# EAGLE board LTC6811_slave_24s_rev0 (EAGLE 9.3.1)
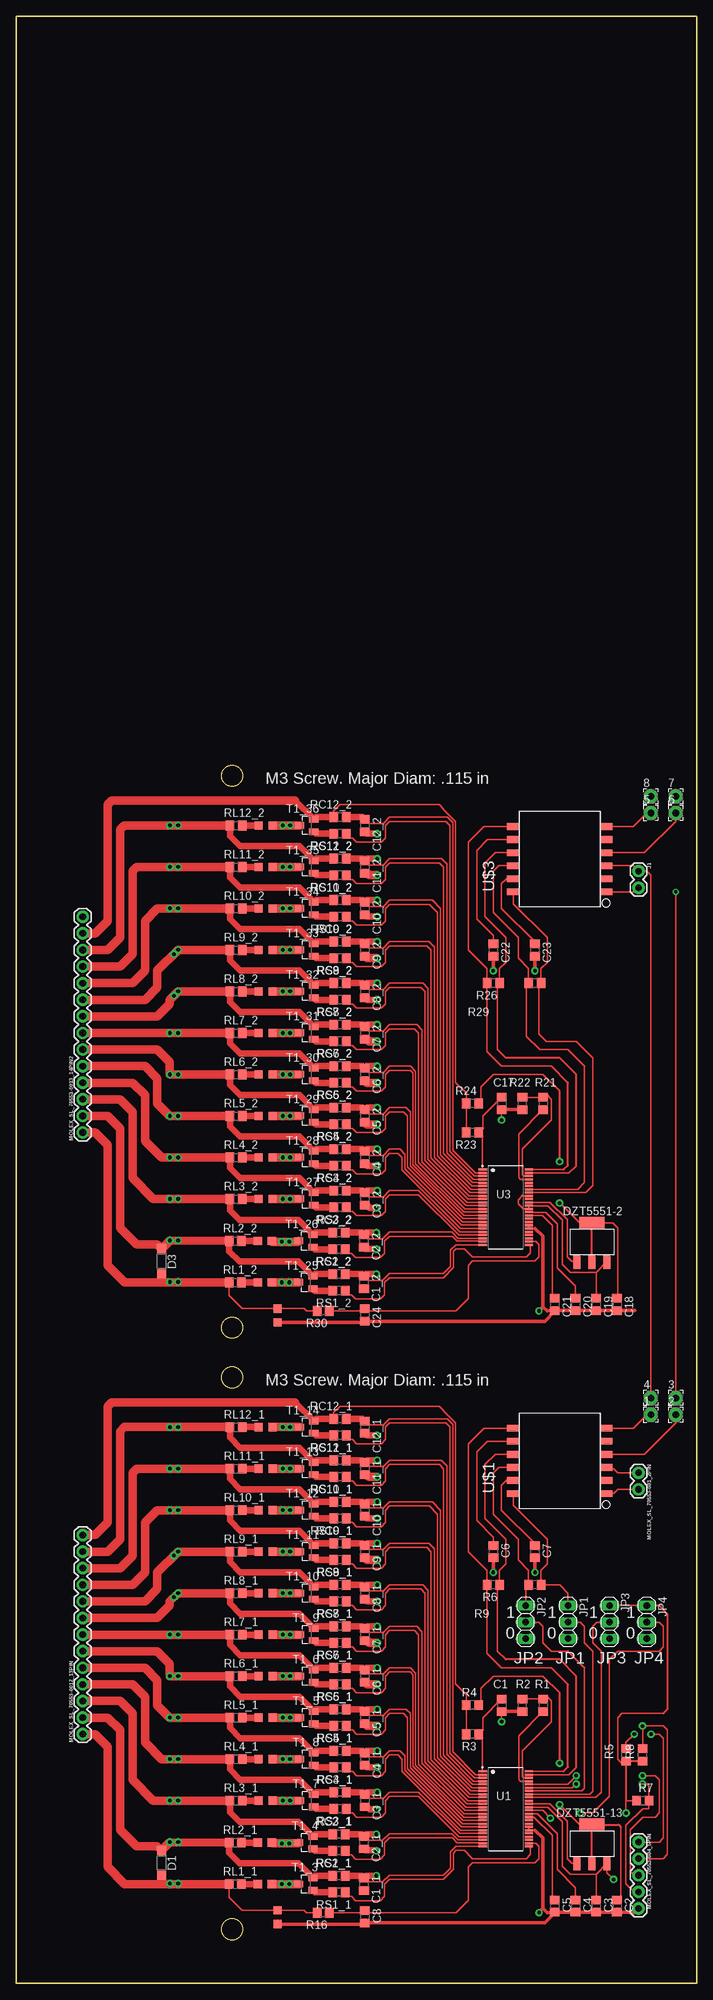
[diagram p2: board, top side]
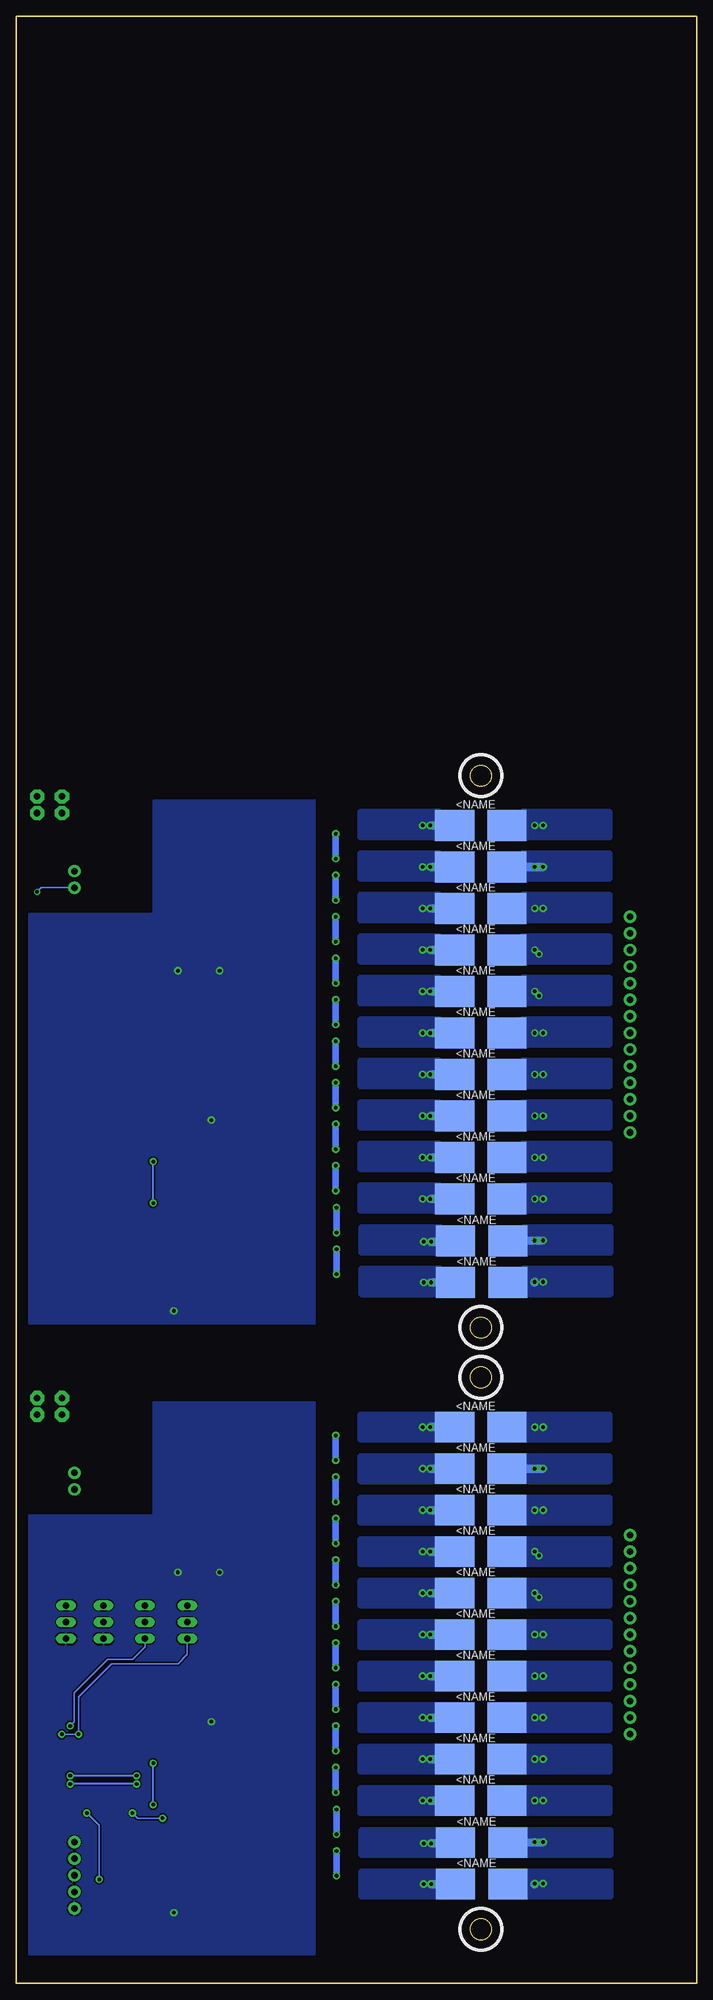
[diagram p3: board, bottom side, seen from below]

Size 104.14 x 300.99 mm. Coordinates in mm from the lower left corner, seen from the top.
Outline: 0,0 104.14,0 104.14,300.99 0,300.99 0,0
Outline: circle at 33.02,92.71 radius 1.59
Outline: circle at 33.02,8.26 radius 1.59
Outline: circle at 33.02,184.78 radius 1.59
Outline: circle at 33.02,100.33 radius 1.59
Copper layers (1*16): Top 0.035mm / dielectric 1.5mm / Bottom 0.035mm
Design rules "default *": minimum track width 6mil, minimum drill 0.53mm, track to track 8mil, track to pad 6mil, pad to pad 6mil, via to via 6mil, smd to smd 6mil, copper to edge 40mil, drill to drill 6mil, minimum pad ring 10mil, minimum via ring 8mil, stop-mask expansion 4mil, vias tented up to drill 0mil, thermal gap 10mil

## Footprints (pad centres in the part's own frame; a part is rotated, then mirrored left to right if it is on the bottom)
2,15/1,0 = drill 1.016 pad 2.159 octagon: 1 0,0
C0805 = smd 1.3 x 1.5: 1 -0.95,0; 2 0.95,0
SOD123 = smd 1.4 x 1.4: A 1.9,0; C -1.9,0
SOT223-4 = smd 1.067 x 2.184: B -2.3,-3; C@2 0,-3; E 2.3,-3 | smd 3.81 x 1.93: C 0,2.9
1X02 = drill 1.016 pad 1.88: 1 0,0; 2 2.54,0
1X03 = drill 1.016 long: 1 -2.54,0; 2 0,0; 3 2.54,0
0805_COMPONENT = smd 1.27 x 1.27: 1 -1,0; 2 1.127,0
1X05 = drill 1.016 pad 1.88: 1 0,0; 2 2.54,0; 3 5.08,0; 4 7.62,0; 5 10.16,0
1X13 = drill 1.016 pad 1.88: 1 0,0; 2 2.54,0; 3 5.08,0; 4 7.62,0; 5 10.16,0; 6 12.7,0; 7 15.24,0; 8 17.78,0; 9 20.32,0; 10 22.86,0; 11 25.4,0; 12 27.94,0; 13 30.48,0
1X14 = drill 1.016 pad 1.88: 1 0,0; 2 2.54,0; 3 5.08,0; 4 7.62,0; 5 10.16,0; 6 12.7,0; 7 15.24,0; 8 17.78,0; 9 20.32,0; 10 22.86,0; 11 25.4,0; 12 27.94,0; 13 30.48,0; 14 33.02,0
R0805 = smd 1.3 x 1.5: 1 -0.95,0; 2 0.95,0
2817_COMPONENT = smd 6 x 4.7: 1 -4,0; 2 4,0
SOT23 = smd 1 x 1.4: C 0.95,-1.1; E 0,1.1; G -0.95,-1.1
LTC6811-1 = smd 1.44 x 0.34: 1 -3.54,5.75; 2 -3.54,5.25; 3 -3.54,4.75; 4 -3.54,4.25; 5 -3.54,3.75; 6 -3.54,3.25; 7 -3.54,2.75; 8 -3.54,2.25; 9 -3.54,1.75; 10 -3.54,1.25; 11 -3.54,0.75; 12 -3.54,0.25; 13 -3.54,-0.25; 14 -3.54,-0.75; 15 -3.54,-1.25; 16 -3.54,-1.75; 17 -3.54,-2.25; 18 -3.54,-2.75; 19 -3.54,-3.25; 20 -3.54,-3.75; 21 -3.54,-4.25; 22 -3.54,-4.75; 23 -3.54,-5.25; 24 -3.54,-5.75; 25 3.54,-5.75; 26 3.54,-5.25; 27 3.54,-4.75; 28 3.54,-4.25; 29 3.54,-3.75; 30 3.54,-3.25; 31 3.54,-2.75; 32 3.54,-2.25; 33 3.54,-1.75; 34 3.54,-1.25; 35 3.54,-0.75; 36 3.54,-0.25; 37 3.54,0.25; 38 3.54,0.75; 39 3.54,1.25; 40 3.54,1.75; 41 3.54,2.25; 42 3.54,2.75; 43 3.54,3.25; 44 3.54,3.75; 45 3.54,4.25; 46 3.54,4.75; 47 3.54,5.25; 48 3.54,5.75
HM2112ZNL_12SMT = smd 1.02 x 1.89: 1 0,-7.145; 2 2,-7.145; 3 4,-7.145; 4 6,-7.145; 5 8,-7.145; 6 10,-7.145; 7 10,7.145; 8 8,7.145; 9 6,7.145; 10 4,7.145; 11 2,7.145; 12 0,7.145

## Placement (x,y rotation side)
1  [2,15/1,0]  97.16,87 0 top
2  [2,15/1,0]  100.97,87 0 top
3  [2,15/1,0]  100.97,89.53 0 top
4  [2,15/1,0]  97.16,89.53 0 top
5  [2,15/1,0]  97.16,179.07 0 top
6  [2,15/1,0]  100.97,179.07 0 top
7  [2,15/1,0]  100.97,181.61 0 top
8  [2,15/1,0]  97.16,181.61 0 top
C1  100.0nF  [C0805]  74.3,42.55 270 top
C1_1  10nF  [C0805]  53.21,15.16 270 top
C1_2  10nF  [C0805]  53.21,107.24 270 top
C2  100nF  [C0805]  91.95,11.81 270 top
C2_1  10nF  [C0805]  53.21,21.51 270 top
C2_2  10nF  [C0805]  53.21,113.59 270 top
C3  1uF  [C0805]  88.77,11.81 270 top
C3_1  10nF  [C0805]  53.34,27.94 270 top
C3_2  10nF  [C0805]  53.34,120.02 270 top
C4  1uF  [C0805]  85.6,11.81 270 top
C4_1  10nF  [C0805]  53.34,34.29 270 top
C4_2  10nF  [C0805]  53.34,126.36 270 top
C5  1uF  [C0805]  82.42,11.81 270 top
C5_1  10nF  [C0805]  53.34,40.64 270 top
C5_2  10nF  [C0805]  53.34,132.71 270 top
C6  10nF  [C0805]  73.03,66.04 270 top
C6_1  10nF  [C0805]  53.34,46.99 270 top
C6_2  10nF  [C0805]  53.34,139.06 270 top
C7  10nF  [C0805]  79.38,66.04 270 top
C7_1  10nF  [C0805]  53.34,53.34 270 top
C7_2  10nF  [C0805]  53.34,145.41 270 top
C8  10nF  [C0805]  53.34,10.16 270 top
C8_1  10nF  [C0805]  53.34,59.69 270 top
C8_2  10nF  [C0805]  53.34,151.76 270 top
C9_1  10nF  [C0805]  53.34,66.04 270 top
C9_2  10nF  [C0805]  53.34,158.11 270 top
C10_1  10nF  [C0805]  53.34,72.39 270 top
C10_2  10nF  [C0805]  53.34,164.46 270 top
C11_1  10nF  [C0805]  53.34,78.74 270 top
C11_2  10nF  [C0805]  53.34,170.81 270 top
C12_1  10nF  [C0805]  53.34,85.09 270 top
C12_2  10nF  [C0805]  53.34,177.16 270 top
C17  100.0nF  [C0805]  74.3,134.62 270 top
C18  100nF  [C0805]  91.95,103.89 270 top
C19  1uF  [C0805]  88.77,103.89 270 top
C20  1uF  [C0805]  85.6,103.89 270 top
C21  1uF  [C0805]  82.42,103.89 270 top
C22  10nF  [C0805]  73.03,158.11 270 top
C23  10nF  [C0805]  79.38,158.11 270 top
C24  10nF  [C0805]  53.34,102.23 270 top
D1  BAT46W-7-F  [SOD123]  22.23,18.41 270 top
D3  BAT46W-7-F  [SOD123]  22.23,110.49 270 top
DZT5551-2  DZT5551-13  [SOT223-4]  88.14,113.41 0 top
DZT5551-13  DZT5551-13  [SOT223-4]  88.14,21.34 0 top
J1  [1X02]  95.25,170.18 270 top
JP1  [1X03]  84.45,55.25 270 top
JP2  [1X03]  77.98,55.25 270 top
JP3  [1X03]  90.81,55.25 270 top
JP4  [1X03]  96.52,55.25 270 top
L1  600 OHMS  [0805_COMPONENT]  40,10.16 270 top
L2  600 OHMS  [0805_COMPONENT]  40,102.23 270 top
LED1_3  LED_0805  [0805_COMPONENT]  37.97,15.16 0 top
LED1_4  LED_0805  [0805_COMPONENT]  37.97,21.51 0 top
LED1_5  LED_0805  [0805_COMPONENT]  38.1,40.64 0 top
LED1_6  LED_0805  [0805_COMPONENT]  38.1,46.99 0 top
LED1_7  LED_0805  [0805_COMPONENT]  38.1,27.94 0 top
LED1_8  LED_0805  [0805_COMPONENT]  38.1,34.29 0 top
LED1_9  LED_0805  [0805_COMPONENT]  38.1,53.34 0 top
LED1_10  LED_0805  [0805_COMPONENT]  38.1,59.69 0 top
LED1_11  LED_0805  [0805_COMPONENT]  38.1,66.04 0 top
LED1_12  LED_0805  [0805_COMPONENT]  38.1,72.39 0 top
LED1_13  LED_0805  [0805_COMPONENT]  38.1,78.74 0 top
LED1_14  LED_0805  [0805_COMPONENT]  38.1,85.09 0 top
LED1_25  LED_0805  [0805_COMPONENT]  37.97,107.24 0 top
LED1_26  LED_0805  [0805_COMPONENT]  37.97,113.59 0 top
LED1_27  LED_0805  [0805_COMPONENT]  38.1,120.02 0 top
LED1_28  LED_0805  [0805_COMPONENT]  38.1,126.36 0 top
LED1_29  LED_0805  [0805_COMPONENT]  38.1,132.71 0 top
LED1_30  LED_0805  [0805_COMPONENT]  38.1,139.06 0 top
LED1_31  LED_0805  [0805_COMPONENT]  38.1,145.41 0 top
LED1_32  LED_0805  [0805_COMPONENT]  38.1,151.76 0 top
LED1_33  LED_0805  [0805_COMPONENT]  38.1,158.11 0 top
LED1_34  LED_0805  [0805_COMPONENT]  38.1,164.46 0 top
LED1_35  LED_0805  [0805_COMPONENT]  38.1,170.81 0 top
LED1_36  LED_0805  [0805_COMPONENT]  38.1,177.16 0 top
MOLEX_SL_70553-001_2PIN  [1X02]  95.25,78.11 270 top
MOLEX_SL_70553-004_5PIN  [1X05]  95.25,21.59 270 top
MOLEX_SL_70553-0012_13PIN  [1X13]  10.16,38.1 90 top
MOLEX_SL_70553-0013_14PIN2  [1X14]  10.16,130.17 90 top
R1  1k  [R0805]  80.64,42.55 270 top
R2  1k  [R0805]  77.47,42.55 90 top
R3  100.0  [R0805]  69.85,38.1 180 top
R4  100.0  [R0805]  69.85,42.55 180 top
R5  1M  [R0805]  93.34,34.93 90 top
R6  100  [R0805]  73.03,60.96 180 top
R7  1M  [R0805]  95.89,27.94 0 top
R8  1M  [R0805]  95.89,34.93 90 top
R9  100  [R0805]  79.38,60.96 180 top
R16  100.0  [R0805]  46.99,10.79 180 top
R21  1k  [R0805]  80.64,134.62 270 top
R22  1k  [R0805]  77.47,134.62 90 top
R23  100.0  [R0805]  69.85,130.17 180 top
R24  100.0  [R0805]  69.85,134.62 180 top
R26  100  [R0805]  73.03,153.03 180 top
R29  100  [R0805]  79.38,153.03 180 top
R30  100.0  [R0805]  46.99,102.87 180 top
RB1_1  27  [2817_COMPONENT]  32.89,15.16 0 bottom
RB1_2  27  [2817_COMPONENT]  32.89,107.24 0 bottom
RB2_1  27  [2817_COMPONENT]  32.89,21.51 0 bottom
RB2_2  27  [2817_COMPONENT]  32.89,113.59 0 bottom
RB3_1  27  [2817_COMPONENT]  33.02,27.94 0 bottom
RB3_2  27  [2817_COMPONENT]  33.02,120.02 0 bottom
RB4_1  27  [2817_COMPONENT]  33.02,34.29 0 bottom
RB4_2  27  [2817_COMPONENT]  33.02,126.36 0 bottom
RB5_1  27  [2817_COMPONENT]  33.02,40.64 0 bottom
RB5_2  27  [2817_COMPONENT]  33.02,132.71 0 bottom
RB6_1  27  [2817_COMPONENT]  33.02,46.99 0 bottom
RB6_2  27  [2817_COMPONENT]  33.02,139.06 0 bottom
RB7_1  27  [2817_COMPONENT]  33.02,53.34 0 bottom
RB7_2  27  [2817_COMPONENT]  33.02,145.41 0 bottom
RB8_1  27  [2817_COMPONENT]  33.02,59.69 0 bottom
RB8_2  27  [2817_COMPONENT]  33.02,151.76 0 bottom
RB9_1  27  [2817_COMPONENT]  33.02,66.04 0 bottom
RB9_2  27  [2817_COMPONENT]  33.02,158.11 0 bottom
RB10_1  27  [2817_COMPONENT]  33.02,72.39 0 bottom
RB10_2  27  [2817_COMPONENT]  33.02,164.46 0 bottom
RB11_1  27  [2817_COMPONENT]  33.02,78.74 0 bottom
RB11_2  27  [2817_COMPONENT]  33.02,170.81 0 bottom
RB12_1  27  [2817_COMPONENT]  33.02,85.09 0 bottom
RB12_2  27  [2817_COMPONENT]  33.02,177.16 0 bottom
RC1_1  100.0  [R0805]  49.4,16.43 180 top
RC1_2  100.0  [R0805]  49.4,108.51 180 top
RC2_1  100.0  [R0805]  49.4,22.78 180 top
RC2_2  100.0  [R0805]  49.4,114.86 180 top
RC3_1  100.0  [R0805]  49.53,29.21 180 top
RC3_2  100.0  [R0805]  49.53,121.28 180 top
RC4_1  100.0  [R0805]  49.53,35.56 180 top
RC4_2  100.0  [R0805]  49.53,127.64 180 top
RC5_1  100.0  [R0805]  49.53,41.91 180 top
RC5_2  100.0  [R0805]  49.53,133.98 180 top
RC6_1  100.0  [R0805]  49.53,48.26 180 top
RC6_2  100.0  [R0805]  49.53,140.33 180 top
RC7_1  100.0  [R0805]  49.53,54.61 180 top
RC7_2  100.0  [R0805]  49.53,146.68 180 top
RC8_1  100.0  [R0805]  49.53,60.96 180 top
RC8_2  100.0  [R0805]  49.53,153.03 180 top
RC9_1  100.0  [R0805]  49.53,67.31 180 top
RC9_2  100.0  [R0805]  49.53,159.38 180 top
RC10_1  100.0  [R0805]  49.53,73.66 180 top
RC10_2  100.0  [R0805]  49.53,165.73 180 top
RC11_1  100.0  [R0805]  49.53,80.01 180 top
RC11_2  100.0  [R0805]  49.53,172.08 180 top
RC12_1  100.0  [R0805]  49.53,86.36 180 top
RC12_2  100.0  [R0805]  49.53,178.43 180 top
RL1_1  140  [R0805]  33.53,15.16 0 top
RL1_2  140  [R0805]  33.53,107.24 0 top
RL2_1  140  [R0805]  33.53,21.51 0 top
RL2_2  140  [R0805]  33.53,113.59 0 top
RL3_1  140  [R0805]  33.66,27.94 0 top
RL3_2  140  [R0805]  33.66,120.02 0 top
RL4_1  140  [R0805]  33.66,34.29 0 top
RL4_2  140  [R0805]  33.66,126.36 0 top
RL5_1  140  [R0805]  33.66,40.64 0 top
RL5_2  140  [R0805]  33.66,132.71 0 top
RL6_1  140  [R0805]  33.66,46.99 0 top
RL6_2  140  [R0805]  33.66,139.06 0 top
RL7_1  140  [R0805]  33.66,53.34 0 top
RL7_2  140  [R0805]  33.66,145.41 0 top
RL8_1  140  [R0805]  33.66,59.69 0 top
RL8_2  140  [R0805]  33.66,151.76 0 top
RL9_1  140  [R0805]  33.66,66.04 0 top
RL9_2  140  [R0805]  33.66,158.11 0 top
RL10_1  140  [R0805]  33.66,72.39 0 top
RL10_2  140  [R0805]  33.66,164.46 0 top
RL11_1  140  [R0805]  33.66,78.74 0 top
RL11_2  140  [R0805]  33.66,170.81 0 top
RL12_1  140  [R0805]  33.66,85.09 0 top
RL12_2  140  [R0805]  33.66,177.16 0 top
RS1_1  3.3k  [R0805]  49.4,13.89 180 top
RS1_2  3.3k  [R0805]  49.4,105.97 180 top
RS2_1  3.3k  [R0805]  49.4,20.24 180 top
RS2_2  3.3k  [R0805]  49.4,112.32 180 top
RS3_1  3.3k  [R0805]  49.53,26.67 180 top
RS3_2  3.3k  [R0805]  49.53,118.75 180 top
RS4_1  3.3k  [R0805]  49.53,33.02 180 top
RS4_2  3.3k  [R0805]  49.53,125.1 180 top
RS5_1  3.3k  [R0805]  49.53,39.37 180 top
RS5_2  3.3k  [R0805]  49.53,131.44 180 top
RS6_1  3.3k  [R0805]  49.53,45.72 180 top
RS6_2  3.3k  [R0805]  49.53,137.79 180 top
RS7_1  3.3k  [R0805]  49.53,52.07 180 top
RS7_2  3.3k  [R0805]  49.53,144.14 180 top
RS8_1  3.3k  [R0805]  49.53,58.42 180 top
RS8_2  3.3k  [R0805]  49.53,150.49 180 top
RS9_1  3.3k  [R0805]  49.53,64.77 180 top
RS9_2  3.3k  [R0805]  49.53,156.84 180 top
RS10_1  3.3k  [R0805]  49.53,71.12 180 top
RS10_2  3.3k  [R0805]  49.53,163.19 180 top
RS11_1  3.3k  [R0805]  49.53,77.47 180 top
RS11_2  3.3k  [R0805]  49.53,169.54 180 top
RS12_1  3.3k  [R0805]  49.53,83.82 180 top
RS12_2  3.3k  [R0805]  49.53,175.89 180 top
T1_3  BSS308PEH6327  [SOT23]  44.32,15.16 90 top
T1_4  BSS308PEH6327  [SOT23]  44.32,21.51 90 top
T1_5  BSS308PEH6327  [SOT23]  44.45,40.64 90 top
T1_6  BSS308PEH6327  [SOT23]  44.45,46.99 90 top
T1_7  BSS308PEH6327  [SOT23]  44.45,27.94 90 top
T1_8  BSS308PEH6327  [SOT23]  44.45,34.29 90 top
T1_9  BSS308PEH6327  [SOT23]  44.45,53.34 90 top
T1_10  BSS308PEH6327  [SOT23]  44.45,59.69 90 top
T1_11  BSS308PEH6327  [SOT23]  44.45,66.04 90 top
T1_12  BSS308PEH6327  [SOT23]  44.45,72.39 90 top
T1_13  BSS308PEH6327  [SOT23]  44.45,78.74 90 top
T1_14  BSS308PEH6327  [SOT23]  44.45,85.09 90 top
T1_25  BSS308PEH6327  [SOT23]  44.32,107.24 90 top
T1_26  BSS308PEH6327  [SOT23]  44.32,113.59 90 top
T1_27  BSS308PEH6327  [SOT23]  44.45,120.02 90 top
T1_28  BSS308PEH6327  [SOT23]  44.45,126.36 90 top
T1_29  BSS308PEH6327  [SOT23]  44.45,132.71 90 top
T1_30  BSS308PEH6327  [SOT23]  44.45,139.06 90 top
T1_31  BSS308PEH6327  [SOT23]  44.45,145.41 90 top
T1_32  BSS308PEH6327  [SOT23]  44.45,151.76 90 top
T1_33  BSS308PEH6327  [SOT23]  44.45,158.11 90 top
T1_34  BSS308PEH6327  [SOT23]  44.45,164.46 90 top
T1_35  BSS308PEH6327  [SOT23]  44.45,170.81 90 top
T1_36  BSS308PEH6327  [SOT23]  44.45,177.16 90 top
U1  LTC6811HG-2#PBF  [LTC6811-1]  74.93,26.67 0 top
U3  LTC6811HG-2#PBF  [LTC6811-1]  74.93,118.75 0 top
U$1  HM2112ZNL_PULSE_ELECTRONICS_TRANSFORMER  [HM2112ZNL_12SMT]  83.19,74.93 90 top
U$3  HM2112ZNL_PULSE_ELECTRONICS_TRANSFORMER  [HM2112ZNL_12SMT]  83.19,167 90 top

## Tracks (layer width: path | path; a pad name or v marks a point on that pad's centre or on a via)
C0_1
  Top 0.203: U1.26 79.55,21.42 80.01,20.95 80.01,19.05 79.38,18.41 69.85,18.41 69.22,17.78 69.22,12.7 67.31,10.79 53.66,10.79 C8.1 53.03,10.79 R16.1
C0_2
  Top 0.203: U3.26 79.55,113.5 80.01,113.03 80.01,111.12 79.38,110.49 69.85,110.49 69.22,109.86 69.22,104.78 67.31,102.87 53.66,102.87 C24.1 53.03,102.87 R30.1
C1_1  (via drill 0.55 pad 1.1)
  Top 0.203: C1_1.1 53.85,15.48 56.07,15.48 57.1,16.51 65.42,16.51 66.5,17.59 66.5,20.14 67.28,20.92 U1.24
  Top 1.016: RC1_1.1 52.89,16.43 C1_1.1 53.53,16.43 v55.12,16.43 | C2_1.2 53.46,20.32 55.04,20.32 v55.12,20.24
  Bottom 1.016: v55.12,16.43 v55.12,20.24
C1_2  (via drill 0.55 pad 1.1)
  Top 0.203: C1_2.1 53.85,107.55 56.07,107.55 57.1,108.59 65.42,108.59 66.5,109.67 66.5,112.22 67.28,113 U3.24
  Top 1.016: RC1_2.1 52.89,108.51 C1_2.1 53.53,108.51 v55.12,108.51 | C2_2.2 53.46,112.39 55.04,112.39 v55.12,112.32
  Bottom 1.016: v55.12,108.51 v55.12,112.32
C2_1  (via drill 0.55 pad 1.1)
  Top 0.203: C2_1.1 53.85,21.83 56.07,21.83 57.1,22.86 66.67,22.86 67.61,21.92 U1.22
  Top 1.016: RC2_1.1 52.89,22.78 C2_1.1 53.53,22.78 v55.12,22.78 | C3_1.2 53.66,26.99 54.05,26.59 v55.12,26.59
  Bottom 1.016: v55.12,22.78 v55.12,26.59
C2_2  (via drill 0.55 pad 1.1)
  Top 0.203: C2_2.1 53.85,113.9 56.07,113.9 57.1,114.94 66.67,114.94 67.61,114 U3.22
  Top 1.016: RC2_2.1 52.89,114.86 C2_2.1 53.53,114.86 v55.12,114.86 | C3_2.2 53.66,119.06 54.05,118.67 v55.12,118.67
  Bottom 1.016: v55.12,114.86 v55.12,118.67
C3_1  (via drill 0.55 pad 1.1)
  Top 0.203: C3_1.1 53.97,28.26 56.19,28.26 57.15,29.21 61.59,29.21 67.89,22.92 U1.20
  Top 1.016: RC3_1.1 53.02,29.21 C3_1.1 53.66,29.21 v55.25,29.21 | C4_1.2 53.66,33.02 v55.25,33.02
  Bottom 1.016: v55.25,29.21 v55.25,33.02
C3_2  (via drill 0.55 pad 1.1)
  Top 0.203: C3_2.1 53.97,120.33 56.19,120.33 57.15,121.28 61.59,121.28 67.89,115 U3.20
  Top 1.016: RC3_2.1 53.02,121.28 C3_2.1 53.66,121.28 v55.25,121.28 | C4_2.2 53.66,125.1 v55.25,125.1
  Bottom 1.016: v55.25,121.28 v55.25,125.1
C4_1  (via drill 0.55 pad 1.1)
  Top 0.203: C4_1.1 53.97,34.61 56.19,34.61 57.15,35.56 58.71,35.56 59.51,34.76 59.51,32.56 68.16,23.92 U1.18
  Top 1.016: RC4_1.1 53.02,35.56 C4_1.1 53.66,35.56 v55.25,35.56
  Top 1.27: C5_1.2 53.66,39.37 v55.25,39.37
  Bottom 1.016: v55.25,35.56 v55.25,39.37
C4_2  (via drill 0.55 pad 1.1)
  Top 0.203: C4_2.1 53.97,126.68 56.19,126.68 57.15,127.64 58.71,127.64 59.51,126.83 59.51,124.64 68.16,116 U3.18
  Top 1.016: RC4_2.1 53.02,127.64 C4_2.1 53.66,127.64 v55.25,127.64
  Top 1.27: C5_2.2 53.66,131.44 v55.25,131.44
  Bottom 1.016: v55.25,127.64 v55.25,131.44
C5_1  (via drill 0.55 pad 1.1)
  Top 0.203: C5_1.1 53.97,40.95 56.19,40.95 57.15,41.91 59.69,41.91 60.33,41.27 60.33,32.99 68.39,24.92 U1.16
  Top 1.016: RC5_1.1 53.02,41.91 C5_1.1 53.66,41.91 v55.25,41.91
  Top 1.27: C6_1.2 53.66,45.72 v55.25,45.72
  Bottom 1.016: v55.25,41.91 v55.25,45.72
C5_2  (via drill 0.55 pad 1.1)
  Top 0.203: C5_2.1 53.97,133.03 56.19,133.03 57.15,133.98 59.69,133.98 60.33,133.35 60.33,125.07 68.39,117 U3.16
  Top 1.016: RC5_2.1 53.02,133.98 C5_2.1 53.66,133.98 v55.25,133.98
  Top 1.27: C6_2.2 53.66,137.79 v55.25,137.79
  Bottom 1.016: v55.25,133.98 v55.25,137.79
C6_1  (via drill 0.55 pad 1.1)
  Top 0.203: C6_1.1 53.97,47.3 56.19,47.3 57.15,48.26 60.31,48.26 61.14,47.44 61.14,33.33 68.54,25.92 U1.14
  Top 1.016: RC6_1.1 53.02,48.26 C6_1.1 53.66,48.26 v55.25,48.26
  Top 1.27: C7_1.2 53.66,52.39 53.97,52.07 v55.25,52.07
  Bottom 1.016: v55.25,48.26 v55.25,52.07
C6_2  (via drill 0.55 pad 1.1)
  Top 0.203: C6_2.1 53.97,139.38 56.19,139.38 57.15,140.33 60.31,140.33 61.14,139.51 61.14,125.4 68.54,118 U3.14
  Top 1.016: RC6_2.1 53.02,140.33 C6_2.1 53.66,140.33 v55.25,140.33
  Top 1.27: C7_2.2 53.66,144.46 53.97,144.14 v55.25,144.14
  Bottom 1.016: v55.25,140.33 v55.25,144.14
C7_1  (via drill 0.55 pad 1.1)
  Top 0.203: C7_1.1 53.97,53.66 56.19,53.66 57.15,54.61 61.3,54.61 62.13,53.79 62.13,33.63 68.84,26.92 U1.12
  Top 1.016: RC7_1.1 53.02,54.61 C7_1.1 53.66,54.61 v55.25,54.61 | C8_1.2 53.66,58.42 v55.25,58.42
  Bottom 1.016: v55.25,54.61 v55.25,58.42
C7_2  (via drill 0.55 pad 1.1)
  Top 0.203: C7_2.1 53.97,145.73 56.19,145.73 57.15,146.68 61.3,146.68 62.13,145.86 62.13,125.7 68.84,119 U3.12
  Top 1.016: RC7_2.1 53.02,146.68 C7_2.1 53.66,146.68 v55.25,146.68 | C8_2.2 53.66,150.49 v55.25,150.49
  Bottom 1.016: v55.25,146.68 v55.25,150.49
C8_1  (via drill 0.55 pad 1.1)
  Top 0.203: C8_1.1 53.97,60 56.19,60 57.15,60.96 62.22,60.96 63.04,60.14 63.04,34.01 69.13,27.92 | U1.10 69.13,27.92 | 69.13,27.92
  Top 1.016: RC8_1.1 53.02,60.96 C8_1.1 53.66,60.96 v55.25,60.96
  Top 1.27: C9_1.2 53.66,64.77 v55.25,64.77
  Bottom 1.016: v55.25,60.96 v55.25,64.77
C8_2  (via drill 0.55 pad 1.1)
  Top 0.203: C8_2.1 53.97,152.08 56.19,152.08 57.15,153.03 62.22,153.03 63.04,152.21 63.04,126.08 69.13,120 | U3.10 69.13,120 | 69.13,120
  Top 1.016: RC8_2.1 53.02,153.03 C8_2.1 53.66,153.03 v55.25,153.03
  Top 1.27: C9_2.2 53.66,156.84 v55.25,156.84
  Bottom 1.016: v55.25,153.03 v55.25,156.84
C9_1  (via drill 0.55 pad 1.1)
  Top 0.203: C9_1.1 53.97,66.36 56.19,66.36 57.15,67.31 63.21,67.31 64.03,66.49 64.03,34.31 69.42,28.92 U1.8
  Top 1.016: RC9_1.1 53.02,67.31 C9_1.1 53.66,67.31 v55.25,67.31 | C10_1.2 53.66,71.12 v55.25,71.12
  Bottom 1.016: v55.25,67.31 v55.25,71.12
C9_2  (via drill 0.55 pad 1.1)
  Top 0.203: C9_2.1 53.97,158.43 56.19,158.43 57.15,159.38 63.21,159.38 64.03,158.56 64.03,126.39 69.42,121 U3.8
  Top 1.016: RC9_2.1 53.02,159.38 C9_2.1 53.66,159.38 v55.25,159.38 | C10_2.2 53.66,163.19 v55.25,163.19
  Bottom 1.016: v55.25,159.38 v55.25,163.19
C10_1  (via drill 0.55 pad 1.1)
  Top 0.203: C10_1.1 53.97,72.7 56.19,72.7 57.15,73.66 63.68,73.66 64.95,72.39 64.95,34.69 69.72,29.92 U1.6
  Top 1.016: RC10_1.1 53.02,73.66 C10_1.1 53.66,73.66 v55.25,73.66
  Top 1.27: C11_1.2 53.66,77.79 53.97,77.47 v55.25,77.47
  Bottom 1.016: v55.25,73.66 v55.25,77.47
C10_2  (via drill 0.55 pad 1.1)
  Top 0.203: C10_2.1 53.97,164.78 56.19,164.78 57.15,165.73 63.68,165.73 64.95,164.46 64.95,126.76 69.72,122 U3.6
  Top 1.016: RC10_2.1 53.02,165.73 C10_2.1 53.66,165.73 v55.25,165.73
  Top 1.27: C11_2.2 53.66,169.86 53.97,169.54 v55.25,169.54
  Bottom 1.016: v55.25,165.73 v55.25,169.54
C11_1  (via drill 0.55 pad 1.1)
  Top 0.203: C11_1.1 53.97,79.06 56.19,79.06 57.15,80.01 65.11,80.01 65.94,79.19 65.94,34.99 70.01,30.92 U1.4
  Top 1.016: RC11_1.1 53.02,80.01 C11_1.1 53.66,80.01 v55.25,80.01 | C12_1.2 53.66,83.82 v55.25,83.82
  Bottom 1.016: v55.25,80.01 v55.25,83.82
C11_2  (via drill 0.55 pad 1.1)
  Top 0.203: C11_2.1 53.97,171.13 56.19,171.13 57.15,172.08 65.11,172.08 65.94,171.26 65.94,127.07 70.01,122.99 U3.4
  Top 1.016: RC11_2.1 53.02,172.08 C11_2.1 53.66,172.08 v55.25,172.08 | C12_2.2 53.66,175.89 v55.25,175.89
  Bottom 1.016: v55.25,172.08 v55.25,175.89
C12_1
  Top 0.203: C12_1.1 53.97,85.41 56.19,85.41 57.15,86.36 66.03,86.36 66.85,85.54 66.85,35.37 70.3,31.92 U1.2
  Top 1.016: RC12_1.1 53.02,86.36 C12_1.1
C12_2
  Top 0.203: C12_2.1 53.97,177.48 56.19,177.48 57.15,178.43 66.03,178.43 66.85,177.61 66.85,127.45 70.3,123.99 U3.2
  Top 1.016: RC12_2.1 53.02,178.43 C12_2.1
C_IN0_1  (via drill 0.55 pad 1.1)
  Top 0.203: RL1_1.1 32.58,13.14 34.56,11.16 L1.1 44.08,11.16 44.45,10.79 R16.2
  Top 1.27: MOLEX_SL_70553-0012_13PIN.1 12.06,38.1 13.97,36.2 13.97,17.78 16.59,15.16 22.23,15.16 | 24.84,15.16 v24.77,15.24 24.69,15.16 | 24.69,15.16 23.42,15.16 | RL1_1.1 24.69,15.16 | v23.49,15.24 23.42,15.16 | 23.42,15.16 22.23,15.16 | D1.A 22.23,15.16
  Bottom 1.27: 24.84,15.16 v24.77,15.24
  pour Bottom (no thermals): 26.54,16.43 26.54,17.07 13.21,17.07 13.21,13.26 26.54,13.26
C_IN0_2  (via drill 0.55 pad 1.1)
  Top 0.203: RL1_2.1 32.58,105.22 34.56,103.23 L2.1 44.08,103.23 44.45,102.87 R30.2
  Top 1.27: MOLEX_SL_70553-0013_14PIN2.1 12.06,130.17 13.97,128.27 13.97,109.86 16.59,107.24 22.23,107.24 | 22.23,107.24 24.69,107.24 v24.77,107.31 24.84,107.24 RL1_2.1 | D3.A 22.23,107.24
  Bottom 1.27: 24.84,107.24 v24.77,107.31
  other vias: 23.49,107.31
  pour Bottom (no thermals): 26.54,105.46 26.54,109.27 13.21,109.27 13.21,105.46
C_IN1_1  (via drill 0.55 pad 1.1)
  Top 1.016: RC1_1.2 45.74,16.43 T1_3.C 43.2,18.34 34.16,18.34 32.58,19.92 RL2_1.1
  Top 1.27: RL2_1.1 v23.49,21.59 23.37,21.46 D1.C 21.59,20.95 18.41,20.95 15.88,23.49 15.88,38.73 13.97,40.64 MOLEX_SL_70553-0012_13PIN.2
  Bottom 1.27: v23.49,21.59 RB2_1.2
  other vias: 24.77,21.59
  pour Bottom (no thermals): 26.54,23.42 13.21,23.42 13.21,19.61 26.54,19.61
C_IN1_2  (via drill 0.55 pad 1.1)
  Top 1.016: RC1_2.2 45.74,108.51 T1_25.C 43.2,110.41 34.16,110.41 32.58,112 RL2_2.1
  Top 1.27: RL2_2.1 v23.49,113.67 23.37,113.53 D3.C 21.59,113.03 18.41,113.03 15.88,115.57 15.88,130.81 13.97,132.71 MOLEX_SL_70553-0013_14PIN2.2
  Bottom 1.27: v23.49,113.67 RB2_2.2
  other vias: 24.77,113.67
  pour Bottom (no thermals): 26.54,115.62 13.21,115.62 13.21,111.81 26.54,111.81
C_IN2_1  (via drill 0.55 pad 1.1)
  Top 1.016: RC2_1.2 45.74,22.78 T1_4.C 43.2,24.69 34.16,24.69 32.7,26.15 RL3_1.1
  Top 1.27: MOLEX_SL_70553-0012_13PIN.3 15.88,43.18 17.78,41.27 17.78,31.12 20.95,27.94 v23.49,27.94 RL3_1.1
  other vias: 24.77,27.94
  pour Bottom (no thermals): 26.67,29.21 26.67,29.84 13.34,29.84 13.34,26.03 26.67,26.03
C_IN2_2  (via drill 0.55 pad 1.1)
  Top 1.016: RC2_2.2 45.74,114.86 T1_26.C 43.2,116.76 34.16,116.76 32.7,118.22 RL3_2.1
  Top 1.27: MOLEX_SL_70553-0013_14PIN2.3 15.88,135.25 17.78,133.35 17.78,123.19 20.95,120.02 v23.49,120.02 RL3_2.1
  other vias: 24.77,120.02
  pour Bottom (no thermals): 26.67,118.24 26.67,122.05 13.34,122.05 13.34,118.24
C_IN3_1  (via drill 0.55 pad 1.1)
  Top 1.016: RC3_1.2 45.87,29.21 T1_7.C 43.33,31.12 34.29,31.12 32.7,32.7 RL4_1.1
  Top 1.27: MOLEX_SL_70553-0012_13PIN.4 17.78,45.72 19.69,43.82 19.69,36.83 22.23,34.29 v23.49,34.29 RL4_1.1
  other vias: 24.77,34.29
  pour Bottom (no thermals): 26.67,36.2 13.34,36.2 13.34,32.39 26.67,32.39
C_IN3_2  (via drill 0.55 pad 1.1)
  Top 1.016: RC3_2.2 45.87,121.28 T1_27.C 43.33,123.19 34.29,123.19 32.7,124.77 RL4_2.1
  Top 1.27: MOLEX_SL_70553-0013_14PIN2.4 17.78,137.79 19.69,135.89 19.69,128.91 22.23,126.36 v23.49,126.36 RL4_2.1
  other vias: 24.77,126.36
  pour Bottom (no thermals): 26.67,128.4 13.34,128.4 13.34,124.59 26.67,124.59
C_IN4_1  (via drill 0.55 pad 1.1)
  Top 1.016: RC4_1.2 45.87,35.56 T1_8.C 43.33,37.47 34.29,37.47 32.7,39.05 RL5_1.1
  Top 1.27: MOLEX_SL_70553-0012_13PIN.5 19.69,48.26 21.59,46.36 21.59,42.55 v23.49,40.64 RL5_1.1
  other vias: 24.77,40.64
  pour Bottom (no thermals): 26.67,41.91 26.67,42.55 13.34,42.55 13.34,38.73 26.67,38.73
C_IN4_2  (via drill 0.55 pad 1.1)
  Top 1.016: RC4_2.2 45.87,127.64 T1_28.C 43.33,129.54 34.29,129.54 32.7,131.12 RL5_2.1
  Top 1.27: MOLEX_SL_70553-0013_14PIN2.5 19.69,140.33 21.59,138.43 21.59,134.62 v23.49,132.71 RL5_2.1
  other vias: 24.77,132.71
  pour Bottom (no thermals): 26.67,130.94 26.67,134.75 13.34,134.75 13.34,130.94
C_IN5_1  (via drill 0.55 pad 1.1)
  Top 1.016: RC5_1.2 45.87,41.91 T1_5.C 43.33,43.82 34.29,43.82 32.7,45.4 RL6_1.1
  Top 1.27: MOLEX_SL_70553-0012_13PIN.6 21.59,50.8 23.49,48.9 v23.49,46.99 RL6_1.1
  other vias: 24.77,46.99
  pour Bottom (no thermals): 26.67,48.9 13.34,48.9 13.34,45.09 26.67,45.09
C_IN5_2  (via drill 0.55 pad 1.1)
  Top 1.016: RC5_2.2 45.87,133.98 T1_29.C 43.33,135.89 34.29,135.89 32.7,137.47 RL6_2.1
  Top 1.27: MOLEX_SL_70553-0013_14PIN2.6 21.59,142.88 23.49,140.97 v23.49,139.06 RL6_2.1
  other vias: 24.77,139.06
  pour Bottom (no thermals): 26.67,141.1 13.34,141.1 13.34,137.29 26.67,137.29
C_IN6_1  (via drill 0.55 pad 1.1)
  Top 1.016: RC6_1.2 45.87,48.26 T1_6.C 43.33,50.16 34.29,50.16 32.7,51.75 RL7_1.1
  Top 1.27: MOLEX_SL_70553-0012_13PIN.7 v24.77,53.34 RL7_1.1
  other vias: 23.49,53.34
  pour Bottom (no thermals): 26.67,54.61 26.67,55.25 13.34,55.25 13.34,51.44 26.67,51.44
C_IN6_2  (via drill 0.55 pad 1.1)
  Top 1.016: RC6_2.2 45.87,140.33 T1_30.C 43.33,142.24 34.29,142.24 32.7,143.82 RL7_2.1
  Top 1.27: MOLEX_SL_70553-0013_14PIN2.7 v24.77,145.41 RL7_2.1
  other vias: 23.49,145.41
  pour Bottom (no thermals): 26.67,143.64 26.67,147.45 13.34,147.45 13.34,143.64
C_IN7_1  (via drill 0.55 pad 1.1)
  Top 1.016: RC7_1.2 45.87,54.61 T1_9.C 43.33,56.52 34.29,56.52 32.7,58.1 RL8_1.1
  Top 1.27: MOLEX_SL_70553-0012_13PIN.8 21.59,55.88 23.49,57.79 23.49,58.42 v24.77,59.69 RL8_1.1
  other vias: 24.13,59.06
  pour Bottom (no thermals): 26.67,61.59 13.34,61.59 13.34,57.79 26.67,57.79
C_IN7_2  (via drill 0.55 pad 1.1)
  Top 1.016: RC7_2.2 45.87,146.68 T1_31.C 43.33,148.59 34.29,148.59 32.7,150.17 RL8_2.1
  Top 1.27: MOLEX_SL_70553-0013_14PIN2.8 21.59,147.95 23.49,149.86 23.49,150.49 v24.77,151.76 RL8_2.1
  other vias: 24.13,151.13
  pour Bottom (no thermals): 26.67,153.8 13.34,153.8 13.34,149.99 26.67,149.99
C_IN8_1  (via drill 0.55 pad 1.1)
  Top 1.016: RC8_1.2 45.87,60.96 T1_10.C 43.33,62.86 34.29,62.86 32.7,64.45 RL9_1.1
  Top 1.27: MOLEX_SL_70553-0012_13PIN.9 19.69,58.42 21.59,60.33 21.59,62.86 v24.77,66.04 RL9_1.1
  other vias: 24.13,65.41
  pour Bottom (no thermals): 26.67,67.31 26.67,67.95 13.34,67.95 13.34,64.14 26.67,64.14
C_IN8_2  (via drill 0.55 pad 1.1)
  Top 1.016: RC8_2.2 45.87,153.03 T1_32.C 43.33,154.94 34.29,154.94 32.7,156.52 RL9_2.1
  Top 1.27: MOLEX_SL_70553-0013_14PIN2.9 19.69,150.49 21.59,152.4 21.59,154.94 v24.77,158.11 RL9_2.1
  other vias: 24.13,157.48
  pour Bottom (no thermals): 26.67,156.34 26.67,160.15 13.34,160.15 13.34,156.34
C_IN9_1  (via drill 0.55 pad 1.1)
  Top 1.016: RC9_1.2 45.87,67.31 T1_11.C 43.33,69.22 34.29,69.22 32.7,70.8 RL10_1.1
  Top 1.27: MOLEX_SL_70553-0012_13PIN.10 17.78,60.96 19.69,62.86 19.69,70.48 21.59,72.39 v23.49,72.39 RL10_1.1
  other vias: 24.77,72.39
  pour Bottom (no thermals): 26.67,74.3 13.34,74.3 13.34,70.48 26.67,70.48
C_IN9_2  (via drill 0.55 pad 1.1)
  Top 1.016: RC9_2.2 45.87,159.38 T1_33.C 43.33,161.29 34.29,161.29 32.7,162.88 RL10_2.1
  Top 1.27: MOLEX_SL_70553-0013_14PIN2.10 17.78,153.03 19.69,154.94 19.69,162.56 21.59,164.46 v23.49,164.46 RL10_2.1
  other vias: 24.77,164.46
  pour Bottom (no thermals): 26.67,166.5 13.34,166.5 13.34,162.69 26.67,162.69
C_IN10_1  (via drill 0.55 pad 1.1)
  Top 1.016: RC10_1.2 45.87,73.66 T1_12.C 43.33,75.56 34.29,75.56 32.7,77.15 RL11_1.1
  Top 1.27: RL11_1.1 v23.49,78.74 18.41,78.74 17.78,78.11 17.78,65.41 15.88,63.5 MOLEX_SL_70553-0012_13PIN.11
  Bottom 1.27: v23.49,78.74 RB11_1.2
  other vias: 24.77,78.74
  pour Bottom (no thermals): 26.67,80.01 26.67,80.64 13.34,80.64 13.34,76.84 26.67,76.84
C_IN10_2  (via drill 0.55 pad 1.1)
  Top 1.016: RC10_2.2 45.87,165.73 T1_34.C 43.33,167.64 34.29,167.64 32.7,169.22 RL11_2.1
  Top 1.27: RL11_2.1 v23.49,170.81 18.41,170.81 17.78,170.18 17.78,157.48 15.88,155.57 MOLEX_SL_70553-0013_14PIN2.11
  Bottom 1.27: v23.49,170.81 RB11_2.2
  other vias: 24.77,170.81
  pour Bottom (no thermals): 26.67,169.04 26.67,172.85 13.34,172.85 13.34,169.04
C_IN11_1  (via drill 0.55 pad 1.1)
  Top 1.016: RC11_1.2 45.87,80.01 T1_13.C 43.33,81.92 34.29,81.92 32.7,83.5 RL12_1.1
  Top 1.27: MOLEX_SL_70553-0012_13PIN.12 13.97,66.04 15.88,67.95 15.88,84.45 16.51,85.09 v23.49,85.09 RL12_1.1
  other vias: 24.77,85.09
  pour Bottom (no thermals): 26.67,87 13.34,87 13.34,83.19 26.67,83.19
C_IN11_2  (via drill 0.55 pad 1.1)
  Top 1.016: RC11_2.2 45.87,172.08 T1_35.C 43.33,173.99 34.29,173.99 32.7,175.57 RL12_2.1
  Top 1.27: MOLEX_SL_70553-0013_14PIN2.12 13.97,158.11 15.88,160.02 15.88,176.53 16.51,177.16 v23.49,177.16 RL12_2.1
  other vias: 24.77,177.16
  pour Bottom (no thermals): 26.67,179.2 13.34,179.2 13.34,175.39 26.67,175.39
C_IN12_1
  Top 0.203: R4.2 68.9,44.13 67.26,45.77 67.26,85.7 65.41,87.56 65.41,87.63 64.77,88.27 49.53,88.27 48.58,87.31 RC12_1.2
  Top 0.254: R3.2 R4.2
  Top 1.016: RC12_1.2 45.87,86.36 T1_14.C 42.69,88.9
  Top 1.27: 42.69,88.9 14.6,88.9 13.97,88.27 13.97,70.48 12.06,68.58 MOLEX_SL_70553-0012_13PIN.13
C_IN12_2
  Top 0.203: R24.2 68.9,136.2 67.26,137.85 67.26,177.78 65.41,179.63 65.41,179.7 64.77,180.34 49.53,180.34 48.58,179.39 RC12_2.2
  Top 0.254: R23.2 R24.2
  Top 1.016: RC12_2.2 45.87,178.43 T1_36.C 42.69,180.97
  Top 1.27: 42.69,180.97 14.6,180.97 13.97,180.34 13.97,162.56 12.06,160.66 MOLEX_SL_70553-0013_14PIN2.13
CS  (via drill 0.55 pad 1.1)
  Top 0.254: MOLEX_SL_70553-004_5PIN.2 99.06,19.05 99.69,19.69 99.69,38.73 99.06,39.37 v95.89,39.37 R8.2
  Bottom 0.254: 95.25,44.45 95.25,40.01 v95.89,39.37 | JP1.3 84.45,51.44 86.36,49.53 90.17,49.53
  Bottom 0.305: 95.25,44.45 90.17,49.53
CS_OR_IMA
  Top 0.254: U1.41 87.82,28.92 88.27,29.36 88.27,50.8 87,52.07 87,54.61 86.36,55.25 JP1.2
DRIVE
  Top 0.254: U1.38 81.67,27.42 84.33,24.77 84.33,19.05 85.04,18.34 DZT5551-13.B
DRIVE_2
  Top 0.254: U3.38 81.67,119.5 84.33,116.84 84.33,111.12 85.04,110.41 DZT5551-2.B
DTEN  (via drill 0.55 pad 1.1)
  Top 0.254: U1.36 80.59,26.42 v81.76,25.25 | v86.36,26.03 88.27,26.03 90.81,28.58 90.81,49.53 92.08,50.8 98.43,50.8 99.06,51.44 99.06,54.61 98.43,55.25 JP4.2
  Bottom 0.254: v86.36,26.03 85.57,25.25 v81.76,25.25
IBIAS
  Top 0.254: U1.45 77.2,30.92 76.92,31.2 76.92,37.87 R1.2
IBIAS_2
  Top 0.254: U3.45 77.2,122.99 76.92,123.27 76.92,129.94 R21.2
ICMP
  Top 0.254: R2.2 R1.1 | 81.28,43.82 81.92,43.18 81.92,40.01 77.47,35.56 77.47,31.69 77.7,31.46 78.43,31.46 U1.46
  Top 0.305: 81.28,43.82 R1.1
ICMP_2
  Top 0.254: R22.2 R21.1 | 81.28,135.89 81.92,135.25 81.92,132.08 77.47,127.64 77.47,123.76 77.7,123.54 78.43,123.54 U3.46
  Top 0.305: 81.28,135.89 R21.1
IMA_1_IN
  Top 0.254: U$1.1 91.44,74.93 92.08,75.56 MOLEX_SL_70553-001_2PIN.2
IMA_2
  Top 0.254: U3.41 87.19,121 88.27,122.07 88.27,141.6 85.72,144.14 81.15,144.14 80.01,145.29 80.01,152.72 R29.1 80.33,155.25 81.28,156.21 81.28,160.02 76.12,165.18 76.12,166.92 U$3.12
IMA_2_IN  (via drill 0.53)
  Top 0.254: U$3.1 94.61,167 J1.2 | v100.97,167 3.1
  Bottom 0.254: J1.2 100.33,167.64 v100.97,167
IMB
  Top 0.254: U1.47 84.62,31.92 | 74.93,49.53 73.66,50.8 73.66,60.33 | R6.1 73.97,63.18 74.93,64.14 74.93,67.95 71.75,71.12 71.75,79.38 73.31,80.93 U$1.9
  Top 0.305: 84.62,31.92 85.72,33.02 85.72,46.99 83.19,49.53 74.93,49.53 | R6.1 73.66,60.33
IMB_1_OUT
  Top 0.254: 2.1 100.97,85.73 96.17,80.93 U$1.4
IMB_2
  Top 0.254: U3.47 84.62,123.99 | 74.93,141.6 73.66,142.88 73.66,152.4 | R26.1 73.97,155.25 74.93,156.21 74.93,160.02 71.75,163.19 71.75,171.45 73.31,173 U$3.9
  Top 0.305: 84.62,123.99 85.72,125.1 85.72,139.06 83.19,141.6 74.93,141.6 | R26.1 73.66,152.4
IMB_2_OUT
  Top 0.254: 6.1 100.97,177.8 96.17,173 U$3.4
IPA_1_IN
  Top 0.254: U$1.3 90.52,78.74 91.44,78.74 92.08,78.11 MOLEX_SL_70553-001_2PIN.1
IPA_2
  Top 0.254: U3.42 85.94,121.5 87,122.56 87,140.33 | 84.45,142.88 80.14,142.88 78.11,144.91 78.11,152.71 R29.2 78.42,155.25 76.83,156.84 76.83,160.02 73.03,163.83 73.03,170.18 73.85,171 U$3.10
  Top 0.305: 87,140.33 84.45,142.88
IPA_2_IN
  Top 0.254: 4.1 97.16,169.54 96.52,170.18 J1.1 94.42,171 U$3.3
IPB
  Top 0.254: U1.48 83.78,32.42 | 84.45,45.72 81.92,48.26 74.3,48.26 72.08,50.48 R6.2 72.08,63.18 69.22,66.04 69.22,82.55 71.59,84.93 U$1.7
  Top 0.305: 83.78,32.42 84.45,33.09 84.45,45.72
IPB_1_OUT
  Top 0.254: 1.1 96.52,87 94.45,84.93 U$1.6
IPB_2
  Top 0.254: U3.48 83.78,124.49 | 84.45,137.79 81.92,140.33 74.3,140.33 72.08,142.55 R26.2 72.08,155.25 69.22,158.11 69.22,174.62 71.59,177 U$3.7
  Top 0.305: 83.78,124.49 84.45,125.17 84.45,137.79
IPB_2_OUT
  Top 0.254: 5.1 96.52,179.07 94.45,177 U$3.6
ISOMD
  Top 0.254: U1.40 88.75,28.42 89.53,29.21 89.53,50.81 88.27,52.08 88.27,54.61 88.9,55.25 JP3.2
N$3
  Top 0.254: C6.1 73.03,68.26 70.48,70.8 70.48,81.28 72.14,82.93 U$1.8
N$5
  Top 0.254: C1.1 71.44,40.64 71.44,38.73 | 71.39,37.51 U1.1
  Top 0.305: 71.44,38.73 R3.1 71.39,37.51
N$7
  Top 0.254: JP2.1 77.98,60.44 R9.2 78.42,63.18 76.83,64.77 76.83,67.95 73.03,71.75 73.03,78.11 73.85,78.93 U$1.10
N$8
  Top 0.254: JP1.1 84.45,59.69 83.19,60.96 R9.1 80.33,63.18 81.28,64.14 81.28,67.95 76.12,73.11 76.12,74.85 U$1.12
N$9
  Top 0.254: C7.1 79.38,67.31 74.3,72.39 74.3,76.2 75.03,76.93 U$1.11
N$32  (via drill 0.55 pad 1.1)
  Top 1.27: LED1_11.2 v40.77,66.04 T1_11.E
  Bottom 1.27: v40.77,66.04 RB9_1.1
  other vias: 41.91,66.04
  pour Bottom (no thermals): 39.37,67.95 51.44,67.95 51.44,64.14 39.37,64.14
N$33
  Top 1.016: T1_11.G 45.87,64.77 RS9_1.2
N$34
  Top 1.016: RL9_1.2 LED1_11.1
N$35  (via drill 0.55 pad 1.1)
  Top 1.27: LED1_12.2 v40.77,72.39 T1_12.E
  Bottom 1.27: v40.77,72.39 RB10_1.1
  other vias: 41.91,72.39
  pour Bottom (no thermals): 39.37,74.3 51.44,74.3 51.44,70.48 39.37,70.48
N$36
  Top 1.016: T1_12.G 45.87,71.12 RS10_1.2
N$37
  Top 1.016: RL10_1.2 LED1_12.1
N$39  (via drill 0.55 pad 1.1)
  Top 1.27: LED1_13.2 v40.77,78.74 T1_13.E
  Bottom 1.27: v40.77,78.74 RB11_1.1
  other vias: 41.91,78.74
  pour Bottom (no thermals): 39.37,80.64 51.44,80.64 51.44,76.84 39.37,76.84
N$40  (via drill 0.55 pad 1.1)
  Top 1.27: LED1_3.2 v40.64,15.16 T1_3.E
  Bottom 1.27: v40.64,15.16 RB1_1.1
  other vias: 41.78,15.16
  pour Bottom (no thermals): 39.24,17.07 51.31,17.07 51.31,13.26 39.24,13.26
N$41
  Top 1.016: T1_3.G 45.74,13.89 RS1_1.2
N$42
  Top 1.016: RL1_1.2 LED1_3.1
N$43  (via drill 0.55 pad 1.1)
  Top 1.27: LED1_4.2 39.23,21.39 v40.64,21.39 43.1,21.39 T1_4.E
  Bottom 1.27: v40.64,21.39 37.02,21.39 RB2_1.1
  other vias: 41.78,21.39
  pour Bottom (no thermals): 39.24,23.42 51.31,23.42 51.31,19.61 39.24,19.61
N$44
  Top 1.016: T1_4.G 45.74,20.24 RS2_1.2
N$45
  Top 1.016: RL2_1.2 LED1_4.1
N$48  (via drill 0.55 pad 1.1)
  Top 1.27: LED1_5.2 v40.77,40.64 T1_5.E
  Bottom 1.27: v40.77,40.64 RB5_1.1
  other vias: 41.91,40.64
  pour Bottom (no thermals): 39.37,42.55 51.44,42.55 51.44,38.73 39.37,38.73
N$49
  Top 1.016: T1_5.G 45.87,39.37 RS5_1.2
N$50
  Top 1.016: RL5_1.2 LED1_5.1
N$51  (via drill 0.55 pad 1.1)
  Top 1.27: LED1_6.2 v40.77,46.99 T1_6.E
  Bottom 1.27: v40.77,46.99 RB6_1.1
  other vias: 41.91,46.99
  pour Bottom (no thermals): 39.37,48.9 51.44,48.9 51.44,45.09 39.37,45.09
N$52
  Top 1.016: T1_6.G 45.87,45.72 RS6_1.2
N$53
  Top 1.016: RL6_1.2 LED1_6.1
N$55  (via drill 0.55 pad 1.1)
  Top 1.27: LED1_9.2 v40.77,53.34 T1_9.E
  Bottom 1.27: v40.77,53.34 RB7_1.1
  other vias: 41.91,53.34
  pour Bottom (no thermals): 39.37,55.25 51.44,55.25 51.44,51.44 39.37,51.44
N$56  (via drill 0.55 pad 1.1)
  Top 1.27: LED1_7.2 v40.77,27.94 T1_7.E
  Bottom 1.27: v40.77,27.94 RB3_1.1
  other vias: 41.91,27.94
  pour Bottom (no thermals): 39.37,29.84 51.44,29.84 51.44,26.03 39.37,26.03
N$57
  Top 1.016: T1_7.G 45.87,26.67 RS3_1.2
N$58
  Top 1.016: RL3_1.2 LED1_7.1
N$59  (via drill 0.55 pad 1.1)
  Top 1.27: LED1_8.2 v40.77,34.29 T1_8.E
  Bottom 1.27: v40.77,34.29 RB4_1.1
  other vias: 41.91,34.29
  pour Bottom (no thermals): 39.37,36.2 51.44,36.2 51.44,32.39 39.37,32.39
N$60
  Top 1.016: T1_8.G 45.87,33.02 RS4_1.2
N$61
  Top 1.016: RL4_1.2 LED1_8.1
N$62
  Top 1.016: T1_13.G 45.87,77.47 RS11_1.2
N$63
  Top 1.016: T1_9.G 45.87,52.07 RS7_1.2
N$64
  Top 1.016: RL7_1.2 LED1_9.1
N$65  (via drill 0.55 pad 1.1)
  Top 1.27: LED1_10.2 v40.77,59.69 T1_10.E
  Bottom 1.27: v40.77,59.69 RB8_1.1
  other vias: 41.91,59.69
  pour Bottom (no thermals): 39.37,61.59 51.44,61.59 51.44,57.79 39.37,57.79
N$66
  Top 1.016: T1_10.G 45.87,58.42 RS8_1.2
N$67
  Top 1.016: RL8_1.2 LED1_10.1
N$69
  Top 1.016: RL11_1.2 LED1_13.1
N$70  (via drill 0.55 pad 1.1)
  Top 1.27: LED1_14.2 v40.77,85.09 T1_14.E
  Bottom 1.27: v40.77,85.09 RB12_1.1
  other vias: 41.91,85.09
  pour Bottom (no thermals): 39.37,87 51.44,87 51.44,83.19 39.37,83.19
N$71
  Top 1.016: T1_14.G 45.87,83.82 RS12_1.2
N$72
  Top 1.016: RL12_1.2 LED1_14.1
N$85
  Top 0.254: C17.1 71.44,132.71 71.44,130.81 | 71.39,129.58 U3.1
  Top 0.305: 71.44,130.81 R23.1 71.39,129.58
N$86
  Top 0.254: C22.1 73.03,160.33 70.48,162.88 70.48,173.35 72.14,175 U$3.8
N$89
  Top 0.254: C23.1 79.38,159.38 74.3,164.46 74.3,168.27 75.03,169 U$3.11
N$90  (via drill 0.55 pad 1.1)
  Top 1.27: LED1_25.2 v40.64,107.24 T1_25.E
  Bottom 1.27: v40.64,107.24 RB1_2.1
  other vias: 41.78,107.24
  pour Bottom (no thermals): 39.24,109.27 51.31,109.27 51.31,105.46 39.24,105.46
N$91
  Top 1.016: T1_25.G 45.74,105.97 RS1_2.2
N$92
  Top 1.016: RL1_2.2 LED1_25.1
N$93  (via drill 0.55 pad 1.1)
  Top 1.27: LED1_26.2 39.23,113.46 v40.64,113.46 43.1,113.46 T1_26.E
  Bottom 1.27: v40.64,113.46 37.02,113.46 RB2_2.1
  other vias: 41.78,113.46
  pour Bottom (no thermals): 39.24,115.62 51.31,115.62 51.31,111.81 39.24,111.81
N$94
  Top 1.016: T1_26.G 45.74,112.32 RS2_2.2
N$95
  Top 1.016: RL2_2.2 LED1_26.1
N$97  (via drill 0.55 pad 1.1)
  Top 1.27: LED1_27.2 v40.77,120.02 T1_27.E
  Bottom 1.27: v40.77,120.02 RB3_2.1
  other vias: 41.91,120.02
  pour Bottom (no thermals): 39.37,122.05 51.44,122.05 51.44,118.24 39.37,118.24
N$98
  Top 1.016: T1_27.G 45.87,118.75 RS3_2.2
N$99
  Top 1.016: RL3_2.2 LED1_27.1
N$100  (via drill 0.55 pad 1.1)
  Top 1.27: LED1_28.2 v40.77,126.36 T1_28.E
  Bottom 1.27: v40.77,126.36 RB4_2.1
  other vias: 41.91,126.36
  pour Bottom (no thermals): 39.37,128.4 51.44,128.4 51.44,124.59 39.37,124.59
N$101
  Top 1.016: T1_28.G 45.87,125.1 RS4_2.2
N$102
  Top 1.016: RL4_2.2 LED1_28.1
N$103  (via drill 0.55 pad 1.1)
  Top 1.27: LED1_29.2 v40.77,132.71 T1_29.E
  Bottom 1.27: v40.77,132.71 RB5_2.1
  other vias: 41.91,132.71
  pour Bottom (no thermals): 39.37,134.75 51.44,134.75 51.44,130.94 39.37,130.94
N$104
  Top 1.016: T1_29.G 45.87,131.44 RS5_2.2
N$105
  Top 1.016: RL5_2.2 LED1_29.1
N$106  (via drill 0.55 pad 1.1)
  Top 1.27: LED1_30.2 v40.77,139.06 T1_30.E
  Bottom 1.27: v40.77,139.06 RB6_2.1
  other vias: 41.91,139.06
  pour Bottom (no thermals): 39.37,141.1 51.44,141.1 51.44,137.29 39.37,137.29
N$107
  Top 1.016: T1_30.G 45.87,137.79 RS6_2.2
N$108
  Top 1.016: RL6_2.2 LED1_30.1
N$109  (via drill 0.55 pad 1.1)
  Top 1.27: LED1_31.2 v40.77,145.41 T1_31.E
  Bottom 1.27: v40.77,145.41 RB7_2.1
  other vias: 41.91,145.41
  pour Bottom (no thermals): 39.37,147.45 51.44,147.45 51.44,143.64 39.37,143.64
N$110
  Top 1.016: T1_31.G 45.87,144.14 RS7_2.2
N$111
  Top 1.016: RL7_2.2 LED1_31.1
N$112  (via drill 0.55 pad 1.1)
  Top 1.27: LED1_32.2 v40.77,151.76 T1_32.E
  Bottom 1.27: v40.77,151.76 RB8_2.1
  other vias: 41.91,151.76
  pour Bottom (no thermals): 39.37,153.8 51.44,153.8 51.44,149.99 39.37,149.99
N$113
  Top 1.016: T1_32.G 45.87,150.49 RS8_2.2
N$114
  Top 1.016: RL8_2.2 LED1_32.1
N$115  (via drill 0.55 pad 1.1)
  Top 1.27: LED1_33.2 v40.77,158.11 T1_33.E
  Bottom 1.27: v40.77,158.11 RB9_2.1
  other vias: 41.91,158.11
  pour Bottom (no thermals): 39.37,160.15 51.44,160.15 51.44,156.34 39.37,156.34
N$116
  Top 1.016: T1_33.G 45.87,156.84 RS9_2.2
N$117
  Top 1.016: RL9_2.2 LED1_33.1
N$118  (via drill 0.55 pad 1.1)
  Top 1.27: LED1_34.2 v40.77,164.46 T1_34.E
  Bottom 1.27: v40.77,164.46 RB10_2.1
  other vias: 41.91,164.46
  pour Bottom (no thermals): 39.37,166.5 51.44,166.5 51.44,162.69 39.37,162.69
N$119
  Top 1.016: T1_34.G 45.87,163.19 RS10_2.2
N$120
  Top 1.016: RL10_2.2 LED1_34.1
N$121  (via drill 0.55 pad 1.1)
  Top 1.27: LED1_35.2 v40.77,170.81 T1_35.E
  Bottom 1.27: v40.77,170.81 RB11_2.1
  other vias: 41.91,170.81
  pour Bottom (no thermals): 39.37,172.85 51.44,172.85 51.44,169.04 39.37,169.04
N$122
  Top 1.016: T1_35.G 45.87,169.54 RS11_2.2
N$123
  Top 1.016: RL11_2.2 LED1_35.1
N$124  (via drill 0.55 pad 1.1)
  Top 1.27: LED1_36.2 v40.77,177.16 T1_36.E
  Bottom 1.27: v40.77,177.16 RB12_2.1
  other vias: 41.91,177.16
  pour Bottom (no thermals): 39.37,179.2 51.44,179.2 51.44,175.39 39.37,175.39
N$125
  Top 1.016: T1_36.G 45.87,175.89 RS12_2.2
N$126
  Top 1.016: RL12_2.2 LED1_36.1
S1_1
  Top 0.203: RS1_1.1 50.99,13.26 51.31,13.26 51.94,12.62 55.75,12.62 56.39,13.26 56.39,15.16 57.1,15.87 65.36,15.87 65.38,15.9 66.9,17.42 66.9,19.91 67.31,20.32 68.58,20.32 69.85,19.05 78.11,19.05 78.74,19.69 78.74,20.65 U1.25
S1_2
  Top 0.203: RS1_2.1 50.99,105.33 51.31,105.33 51.94,104.7 55.75,104.7 56.39,105.33 56.39,107.24 57.1,107.95 65.36,107.95 66.9,109.5 66.9,111.99 67.31,112.39 68.58,112.39 69.85,111.12 78.11,111.12 78.74,111.76 78.74,112.73 U3.25
S2_1
  Top 0.203: RS2_1.1 50.99,19.61 51.31,19.61 51.94,18.97 55.75,18.97 56.39,19.61 56.39,21.51 57.02,22.15 57.1,22.23 66.73,22.23 67.46,21.5 71.31,21.5 U1.23
S2_2
  Top 0.203: RS2_2.1 50.99,111.68 51.31,111.68 51.94,111.05 55.75,111.05 56.39,111.68 56.39,113.59 57.1,114.3 66.73,114.3 67.46,113.57 71.31,113.57 U3.23
S3_1
  Top 0.203: RS3_1.1 51.11,26.03 51.44,26.03 52.07,25.4 55.88,25.4 56.52,26.03 56.52,27.94 57.15,28.58 61.59,28.58 67.75,22.42 U1.21
S3_2
  Top 0.203: RS3_2.1 51.11,118.11 51.44,118.11 52.07,117.48 55.88,117.48 56.52,118.11 56.52,120.02 57.15,120.65 61.59,120.65 67.75,114.5 U3.21
S4_1
  Top 0.203: RS4_1.1 51.11,32.39 51.44,32.39 52.07,31.75 55.88,31.75 56.52,32.39 56.52,34.29 57.15,34.93 58.42,34.93 59.06,34.29 59.06,32.39 68.02,23.42 U1.19
S4_2
  Top 0.203: RS4_2.1 51.11,124.46 51.44,124.46 52.07,123.83 55.88,123.83 56.52,124.46 56.52,126.36 57.15,127 58.42,127 59.06,126.36 59.06,124.46 68.02,115.5 U3.19
S5_1
  Top 0.203: RS5_1.1 51.11,38.73 51.44,38.73 52.07,38.1 55.88,38.1 56.52,38.73 56.52,40.64 57.15,41.27 59.28,41.27 59.92,40.64 59.92,32.82 68.32,24.42 U1.17
S5_2
  Top 0.203: RS5_2.1 51.11,130.81 51.44,130.81 52.07,130.17 55.88,130.17 56.52,130.81 56.52,132.71 57.15,133.35 59.28,133.35 59.92,132.71 59.92,124.9 68.32,116.5 U3.17
S6_1
  Top 0.203: RS6_1.1 51.11,45.09 51.44,45.09 52.07,44.45 55.88,44.45 56.52,45.09 56.52,46.99 57.15,47.62 60.33,47.62 60.73,47.22 60.73,33.16 68.49,25.4 71.37,25.4 U1.15
S6_2
  Top 0.203: RS6_2.1 51.11,137.16 51.44,137.16 52.07,136.52 55.88,136.52 56.52,137.16 56.52,139.06 57.15,139.7 60.33,139.7 60.73,139.29 60.73,125.23 68.49,117.48 71.37,117.48 U3.15
S7_1
  Top 0.203: RS7_1.1 51.11,51.44 51.44,51.44 52.07,50.8 55.88,50.8 56.52,51.44 56.52,53.34 57.15,53.98 60.96,53.98 61.59,53.34 61.59,33.52 68.69,26.42 U1.13
S7_2
  Top 0.203: RS7_2.1 51.11,143.51 51.44,143.51 52.07,142.88 55.88,142.88 56.52,143.51 56.52,145.41 57.15,146.05 60.96,146.05 61.59,145.41 61.59,125.59 68.69,118.5 U3.13
S8_1
  Top 0.203: RS8_1.1 51.11,57.79 51.44,57.79 52.07,57.15 55.88,57.15 56.52,57.79 56.52,59.69 57.15,60.33 61.95,60.33 62.59,59.69 62.59,33.82 68.98,27.42 U1.11
S8_2
  Top 0.203: RS8_2.1 51.11,149.86 51.44,149.86 52.07,149.22 55.88,149.22 56.52,149.86 56.52,151.76 57.15,152.4 61.95,152.4 62.59,151.76 62.59,125.89 68.98,119.5 U3.11
S9_1
  Top 0.203: RS9_1.1 51.11,64.14 51.44,64.14 52.07,63.5 55.88,63.5 56.52,64.14 56.52,66.04 57.15,66.67 62.86,66.67 63.5,66.04 63.5,34.2 69.28,28.42 | U1.9 69.28,28.42 | 69.28,28.42
S9_2
  Top 0.203: RS9_2.1 51.11,156.21 51.44,156.21 52.07,155.57 55.88,155.57 56.52,156.21 56.52,158.11 57.15,158.75 62.86,158.75 63.5,158.11 63.5,126.27 69.28,120.5 | U3.9 69.28,120.5 | 69.28,120.5
S10_1
  Top 0.203: RS10_1.1 51.11,70.48 51.44,70.48 52.07,69.85 55.88,69.85 56.52,70.48 56.52,72.39 57.15,73.03 63.22,73.03 64.49,71.75 64.49,34.5 69.57,29.42 U1.7
S10_2
  Top 0.203: RS10_2.1 51.11,162.56 51.44,162.56 52.07,161.92 55.88,161.92 56.52,162.56 56.52,164.46 57.15,165.1 63.22,165.1 64.49,163.83 64.49,126.58 69.57,121.5 U3.7
S11_1
  Top 0.203: RS11_1.1 51.11,76.84 51.44,76.84 52.07,76.2 55.88,76.2 56.52,76.84 56.52,78.74 57.15,79.38 64.77,79.38 65.41,78.74 65.41,34.88 69.84,30.45 71.36,30.45 U1.5
S11_2
  Top 0.203: RS11_2.1 51.11,168.91 51.44,168.91 52.07,168.27 55.88,168.27 56.52,168.91 56.52,170.81 57.15,171.45 64.77,171.45 65.41,170.81 65.41,126.95 69.84,122.52 71.36,122.52 U3.5
S12_1
  Top 0.203: RS12_1.1 51.11,83.19 51.44,83.19 52.07,82.55 55.88,82.55 56.52,83.19 56.52,85.09 57.15,85.73 65.76,85.73 66.4,85.09 66.4,35.18 70.13,31.45 71.36,31.45 U1.3
S12_2
  Top 0.203: RS12_2.1 51.11,175.26 51.44,175.26 52.07,174.62 55.88,174.62 56.52,175.26 56.52,177.16 57.15,177.8 65.76,177.8 66.4,177.16 66.4,127.26 70.13,123.52 71.36,123.52 U3.3
SCK  (via drill 0.55 pad 1.1)
  Top 0.254: v94.61,38.1 93.34,36.83 R5.2 | MOLEX_SL_70553-004_5PIN.1 98.43,21.59 99.06,22.23 99.06,37.49 98.45,38.1 v97.18,38.1
  Bottom 0.254: v97.18,38.1 v94.61,38.1 94.61,43.82 89.53,48.9 79.38,48.9 77.98,50.29 JP2.3
SCK_OR_IPA
  Top 0.254: U1.42 86.57,29.42 87,29.84 87,48.26 | 84.45,50.8 81.92,50.8 80.64,52.07 80.64,54.61 80.01,55.25 JP2.2
  Top 0.305: 87,48.26 84.45,50.8
SDI  (via drill 0.55 pad 1.1)
  Top 0.203: U1.43 78.51,29.88
  Top 0.254: v85.72,30.48 85.09,29.88 78.51,29.88 | MOLEX_SL_70553-004_5PIN.4 94.61,13.97 93.34,15.24 93.34,24.13 95.89,26.67 96.84,26.67 R7.2 96.84,30.16 96.52,30.48 v95.89,30.48
  Bottom 0.305: v85.72,30.48 v95.89,30.48
SDO  (via drill 0.55 pad 1.1)
  Top 0.254: U1.44 78.5,30.45 84.42,30.45 v85.72,31.75 | v95.89,31.75 97.79,31.75 98.43,31.12 98.43,26.03 97.79,25.4 95.89,25.4 93.98,23.49 93.98,17.15 94.61,16.51 MOLEX_SL_70553-004_5PIN.3
  Bottom 0.305: v85.72,31.75 v95.89,31.75
V-_1  (via drill 0.55 pad 1.1)
  Top 0.152: 79.41,65.05 C7.2
  Top 0.254: U1.31 U1.30 | C1.2 v74.3,40.01
  Top 0.305: U1.30 79.42,23.42 | C5.2 82.55,10.86 | 78.44,23.95 U1.31
  Top 0.508: C2.2 C3.2 C4.2 82.55,10.86 | R2.1 C1.2 | 79.42,23.42 80.64,22.26 80.64,11.43 | 80.64,11.43 81.28,10.79 82.55,10.86 | C6.2 v73.03,62.86 | v79.41,62.86 79.41,65.05 | 82.55,10.86 80.9,9.21 C8.2 53.16,9.03 L1.2 | C2.2 92.01,10.79 | C2.2 94.68,10.86 MOLEX_SL_70553-004_5PIN.5 | 80.64,11.43 v80.01,10.79
  pour Bottom: 58.42,88.9 83.19,88.9 83.19,71.58 102.24,71.58 102.24,4.45 58.42,4.45
V-_2  (via drill 0.55 pad 1.1)
  Top 0.152: 79.41,157.13 C23.2
  Top 0.254: U3.31 U3.30 | C17.2 v74.3,132.08
  Top 0.305: U3.30 79.42,115.5 | C21.2 82.55,102.94 | 78.44,116.02 U3.31
  Top 0.508: C18.2 C19.2 C20.2 82.55,102.94 | R22.1 C17.2 | 79.42,115.5 80.64,114.33 80.64,103.5 | 80.64,103.5 81.28,102.87 82.55,102.94 | C22.2 v73.03,154.94 | v79.41,154.94 79.41,157.13 | 82.55,102.94 80.9,101.28 C24.2 53.16,101.11 L2.2 | C18.2 92.01,102.87 | C18.2 94.68,102.94 | 80.64,103.5 v80.01,102.87
  pour Bottom: 58.42,180.97 83.19,180.97 83.19,163.65 102.24,163.65 102.24,100.97 58.42,100.97
VREF1_C4
  Top 0.254: U1.35 78.5,25.9 79.77,25.9 82.8,22.86 82.8,17.4 85.6,14.6 C4.1
VREF1_C4_2
  Top 0.254: U3.35 78.5,117.97 81.04,117.97 82.8,116.21 82.8,109.47 85.6,106.68 C20.1
VREF2_C5
  Top 0.254: U1.34 78.5,25.4 79.26,25.4 79.26,25.39 82.04,22.61 82.04,13.14 C5.1
VREF2_C5_2
  Top 0.254: U3.34 78.5,117.47 80.53,117.47 80.53,117.46 82.04,115.95 82.04,105.22 C21.1
VREG  (via drill 0.55 pad 1.1)
  Top 0.254: JP4.1 JP3.1 | 88.77,16.67 DZT5551-13.E 90.44,16.88 v91.44,15.87 | 88.77,16.67 C3.1 | U1.37 78.5,26.9 81.39,26.9 83.57,24.72 83.57,17.91 84.8,16.67 88.77,16.67 | 92.71,33.66 92.08,34.29 92.08,40.64 92.71,41.27 99.06,41.27 | 94.61,27.94 93.34,27.94 v93.34,26.03
  Top 0.305: R8.1 R5.1 | JP4.1 98.43,57.79 99.69,56.52 99.69,41.91 99.06,41.27 | R5.1 93.34,27.94 | R7.1 94.61,27.94 | R5.1 92.71,33.66
  Bottom 0.254: v93.34,26.03 91.44,24.13 v91.44,15.87
VREG_2
  Top 0.254: DZT5551-2.E 88.77,108.75 | 88.77,108.75 C19.1 | U3.37 78.5,118.97 | 78.5,118.97 81.39,118.97 83.57,116.79 83.57,109.98 84.8,108.75 88.77,108.75 | U3.40 77.5,120.5 77.47,120.52 76.83,119.89 76.83,119.25 77.59,118.5 U3.36 78.5,118.52 78.5,118.97
VREG_CAP  (via drill 0.55 pad 1.1)
  Top 0.254: 92.58,23.88 92.58,12.76 | 86.33,24.16 v83.19,27.3 | 83.19,44.45 80.64,46.99 73.03,46.99 71.12,45.09 71.12,43.18
  Top 0.305: DZT5551-13.C 92.22,24.24 92.58,23.88 | 92.58,12.76 C2.1 | DZT5551-13.C@2 DZT5551-13.C | DZT5551-13.C 86.33,24.16 | v83.19,33.66 83.19,44.45 | R4.1 71.12,43.18
  Bottom 0.305: v83.19,27.3 v83.19,33.66
VREG_CAP_2  (via drill 0.55 pad 1.1)
  Top 0.254: 86.33,116.23 v83.19,119.38 | 83.19,136.52 80.64,139.06 73.03,139.06 71.12,137.16 71.12,135.25 | DZT5551-2.C 91.33,116.31 92.08,115.57 92.08,104.96 C18.1
  Top 0.305: DZT5551-2.C@2 DZT5551-2.C 86.33,116.23 | v83.19,125.73 83.19,136.52 | R24.1 71.12,135.25
  Bottom 0.305: v83.19,119.38 v83.19,125.73

## Text on the board
tPlace: M3 Screw. Major Diam: .115 in | M3 Screw. Major Diam: .115 in | 1 | 1 | 1 | 1 | 0 | 0 | 0 | 0 | JP2 | JP1 | JP3 | JP4